# Altium project GSM Security Alert.PrjPcb
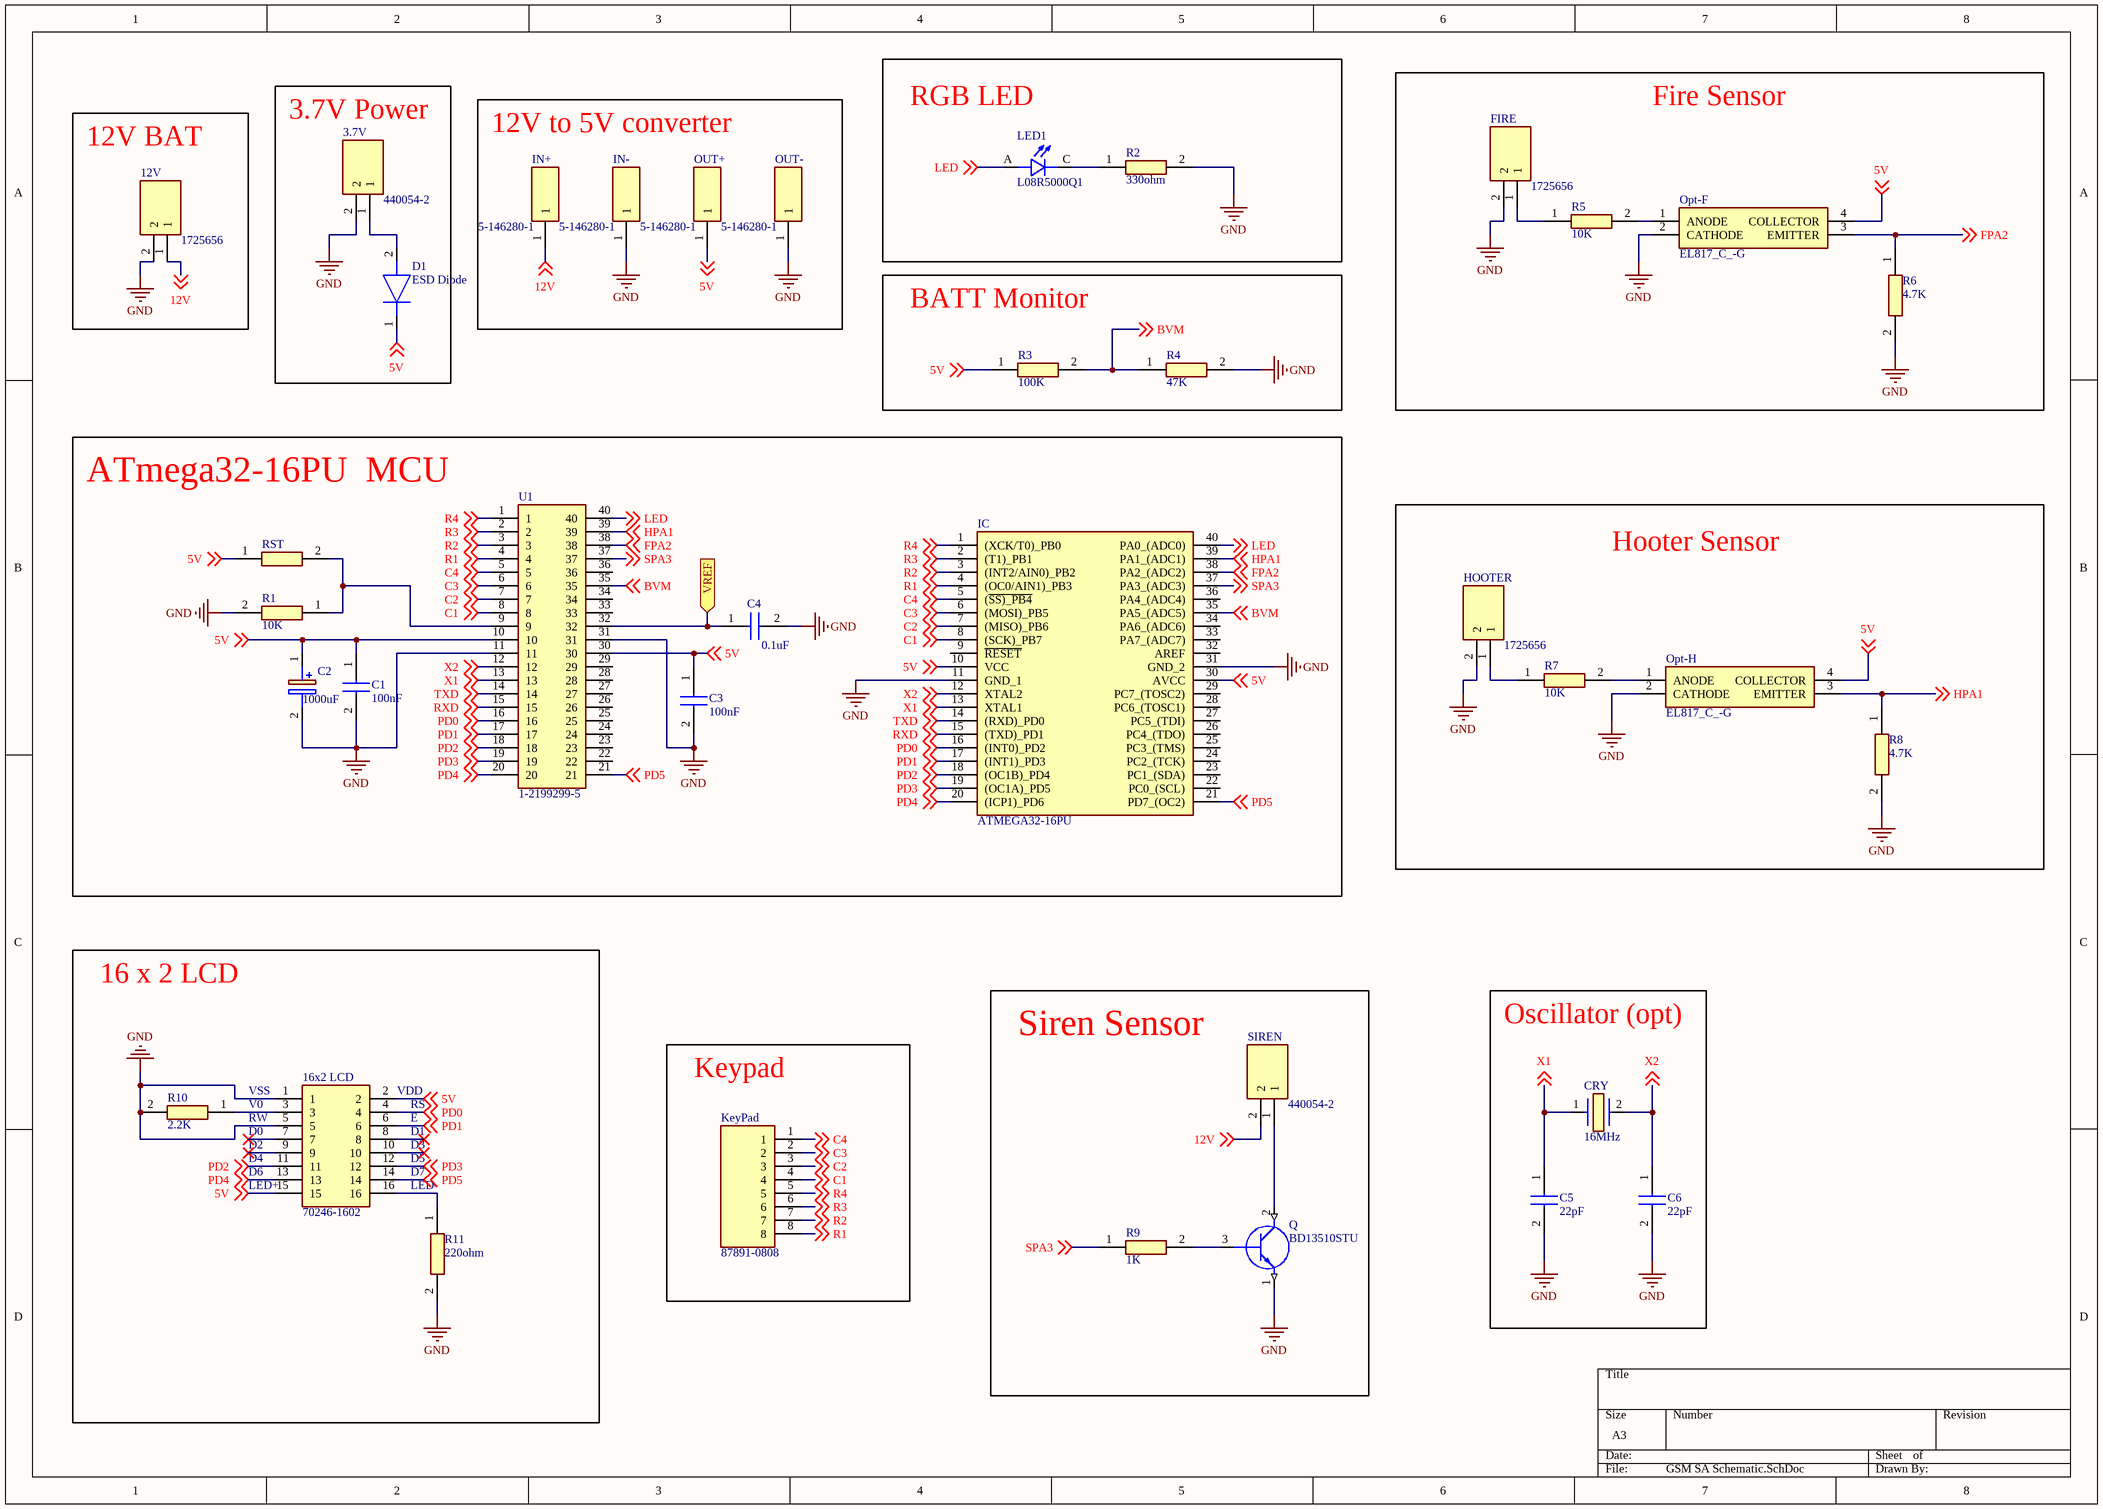
[diagram p0: GSM SA Schematic.SchDoc]
2 sheets, 69 parts. Net scope: flat (ports and power ports of the same name join across sheets).
Board file: GSM.PcbDoc
Sheets:
  GSM SA Schematic.SchDoc
  SIM800C SCH.SchDoc

## Sheet GSM SA Schematic.SchDoc
size A3; SheetNumber: 1; SheetTotal: 2

### Parts
3.7V  440054-2  [SHDR2W70P0X200_1X2_600X470X635P]
12V  1725656  [1725656]
16x2_LCD  70246-1602  [SHDR16W99P254_2X8_2794X889X927P]
C1  100nF  [C1206]
C2  1000uF  [CAPPRD500W65D1000H1750]
C3  100nF  [C1206]
C4  0.1uF  [C1206]
C5  22pF  [C1206]
C6  22pF  [C1206]
CRY  16MHz  [ECS160185PXGMTR]
D1  ESD Diode  [DIOM5336X262N]
FIRE  1725656  [1725656]
HOOTER  1725656  [1725656]
IC  ATMEGA32-16PU  [DIP1556W56P254L5232H483Q40N]
IN+  5-146280-1  [HDRV1W67P0X254_1X1_213X234X821P]
IN-  5-146280-1  [HDRV1W67P0X254_1X1_213X234X821P]
KeyPad  87891-0808  [HDRV8W69P0X254_1X8_2032X251X1641P]
LED1  L08R5000Q1  [LEDRD254W57D500H1070]
Opt-F  EL817_C_-G  [DIP762W60P254L458H480Q4N]
Opt-H  EL817_C_-G  [DIP762W60P254L458H480Q4N]
OUT+  5-146280-1  [HDRV1W67P0X254_1X1_213X234X821P]
OUT-  5-146280-1  [HDRV1W67P0X254_1X1_213X234X821P]
Q  BD13510STU  [TO229P345X800X1460-3P]
R1  10K  [RESC3216X65N]
R2  330ohm  [RESC3216X65N]
R3  100K  [RESC3216X65N]
R4  47K  [RESC3216X65N]
R5  10K  [RESC3216X65N]
R6  4.7K  [RESC3216X65N]
R7  10K  [RESC3216X65N]
R8  4.7K  [RESC3216X65N]
R9  1K  [RESC3116X65N]
R10  2.2K  [RESC3216X65N]
R11  220ohm  [RESC3216X65N]
RST  NP  [RESC3216X65N]  (value not drawn)
SIREN  440054-2  [SHDR2W70P0X200_1X2_600X470X635P]
U1  1-2199299-5  [DIPS1544W70P254L5080H530Q40N]

### Blocks framed on the sheet
RGB LED: LED1 R2
12V BAT: 12V
3.7V Power: 3.7V D1
12V to 5V converter: IN+ IN- OUT+ OUT-
Fire Sensor: FIRE Opt-F R5 R6
BATT Monitor: R3 R4
ATmega32-16PU  MCU: C1-C4 IC R1 RST U1
Hooter Sensor: HOOTER Opt-H R7 R8
16 x 2 LCD: 16x2_LCD R10 R11
Siren Sensor: Q R9 SIREN
Oscillator (opt): C5 C6 CRY
Keypad: KeyPad

### Ports
VREF (in)

### Nets
GND: 3.7V.2 12V.2 16x2_LCD.1 16x2_LCD.5 C1.2 C2.2(-) C3.2 C4.2 C5.2 C6.2 FIRE.2 HOOTER.2 IC.11(GND_1) IC.31(GND_2) IN-.1 Opt-F.2(CATHODE) Opt-H.2(CATHODE) OUT-.1 Q.1(E) R1.2 R2.2 R4.2 R6.2 R8.2 R10.2 R11.2 U1.11 U1.31
5V: 16x2_LCD.2 16x2_LCD.15 C1.1 C2.1(+) C3.1 D1.1(K) IC.10(VCC) IC.30(AVCC) Opt-F.4(COLLECTOR) Opt-H.4(COLLECTOR) OUT+.1 R3.1 RST.1 U1.10 U1.30 ; off-sheet 5V
12V: 12V.1 IN+.1 SIREN.2 ; off-sheet 12V
BVM: IC.35(PA5_(ADC5)) R3.2 R4.1 U1.35 ; off-sheet BVM
C1: IC.8((SCK)_PB7) KeyPad.4 U1.8 ; off-sheet C1
C2: IC.7((MISO)_PB6) KeyPad.3 U1.7 ; off-sheet C2
C3: IC.6((MOSI)_PB5) KeyPad.2 U1.6 ; off-sheet C3
C4: IC.5((~{SS)_PB4}) KeyPad.1 U1.5 ; off-sheet C4
FPA2: IC.38(PA2_(ADC2)) Opt-F.3(EMITTER) R6.1 U1.38 ; off-sheet FPA2
HPA1: IC.39(PA1_(ADC1)) Opt-H.3(EMITTER) R8.1 U1.39 ; off-sheet HPA1
LED: IC.40(PA0_(ADC0)) LED1.A U1.40 ; off-sheet LED
PD0: 16x2_LCD.4 IC.16((INT0)_PD2) U1.16 ; off-sheet PD0
PD1: 16x2_LCD.6 IC.17((INT1)_PD3) U1.17 ; off-sheet PD1
PD2: 16x2_LCD.11 IC.18((OC1B)_PD4) U1.18 ; off-sheet PD2
PD3: 16x2_LCD.12 IC.19((OC1A)_PD5) U1.19 ; off-sheet PD3
PD4: 16x2_LCD.13 IC.20((ICP1)_PD6) U1.20 ; off-sheet PD4
PD5: 16x2_LCD.14 IC.21(PD7_(OC2)) U1.21 ; off-sheet PD5
R1: IC.4((OC0/AIN1)_PB3) KeyPad.8 U1.4 ; off-sheet R1
R2: IC.3((INT2/AIN0)_PB2) KeyPad.7 U1.3 ; off-sheet R2
R3: IC.2((T1)_PB1) KeyPad.6 U1.2 ; off-sheet R3
R4: IC.1((XCK/T0)_PB0) KeyPad.5 U1.1 ; off-sheet R4
RXD: IC.15((TXD)_PD1) U1.15 ; off-sheet RXD
SPA3: IC.37(PA3_(ADC3)) R9.1 U1.37 ; off-sheet SPA3
TXD: IC.14((RXD)_PD0) U1.14 ; off-sheet TXD
X1: C5.1 CRY.1 IC.13(XTAL1) U1.13 ; off-sheet X1
X2: C6.1 CRY.2 IC.12(XTAL2) U1.12 ; off-sheet X2
Net3.7V_1: 3.7V.1 D1.2(A)
Net16x2_LCD_3: 16x2_LCD.3 R10.1
Net16x2_LCD_16: 16x2_LCD.16 R11.1
NetC4_1: C4.1 U1.32 ; port VREF
NetFIRE_1: FIRE.1 R5.1
NetHOOTER_1: HOOTER.1 R7.1
NetLED1_C: LED1.C R2.1
NetOpt-F_1: Opt-F.1(ANODE) R5.2
NetOpt-H_1: Opt-H.1(ANODE) R7.2
NetQ_2: Q.2(C) SIREN.1
NetQ_3: Q.3(B) R9.2
NetR1_1: R1.1 RST.2 U1.9

Not connected (* = marked no-connect by the designer): 16x2_LCD 7* 8* 9* 10*; IC 9(~{RESET}) 22(PC0_(SCL)) 23(PC1_(SDA)) 24(PC2_(TCK)) 25(PC3_(TMS)) 26(PC4_(TDO)) 27(PC5_(TDI)) 28(PC6_(TOSC1)) 29(PC7_(TOSC2)) 32(AREF) 33(PA7_(ADC7)) 34(PA6_(ADC6)) 36(PA4_(ADC4)); U1 22 23 24 25 26 27 28 29 33 34 36

### Notes on the sheet
- VSS
- V0
- RW
- (near 16x2_LCD) VDD
- (near 16x2_LCD) RS
- (near 16x2_LCD) E
- D0
- D2
- D4
- (near 16x2_LCD) D6
- (near 16x2_LCD) LED+
- (near 16x2_LCD) D1
- (near 16x2_LCD) D3
- (near 16x2_LCD) D5
- D7
- LED-

### Library data of the parts
3.7V SIREN = 440054-2: Connector; Manufacturer_Name: TE Connectivity; Datasheet Link: https://www.te.com/commerce/DocumentDelivery/DDEController?Action=showdoc&DocId=Customer+Drawing%7F440054%7FF8%7Fpdf%7FEnglish%7FENG_CD_440054_F8.pdf%7F1-440054-2; Height: 6.35mm; Manufacturer_Part_Number: 440054-2; Mouser Part Number: 571-440054-2; Mouser Price/Stock: https://www.mouser.co.uk/ProductDetail/TE-Connectivity/440054-2?qs=JFPmFzpscO4RQaczYEA68w%3D%3D; Arrow Part Number: 440054-2; Arrow Price/Stock: https://www.arrow.com/en/products/440054-2/te-connectivity?region=europe
12V FIRE HOOTER = 1725656: Connector; Manufacturer_Name: Phoenix Contact; Datasheet Link: https://www.phoenixcontact.com/online/portal/us/?uri=pxc-oc-itemdetail:pid=1725656&library=usen&pcck=P-11-01-05&tab=1&selectedCategory=ALL; Height: 8.65mm; Manufacturer_Part_Number: 1725656; Mouser Part Number: 651-1725656; Mouser Price/Stock: https://www.mouser.co.uk/ProductDetail/Phoenix-Contact/1725656?qs=Ul7CXFMnlWWQeccayYbRmw%3D%3D; Arrow Part Number: 1725656; Arrow Price/Stock: https://www.arrow.com/en/products/1725656/phoenix-contact?region=nac
16x2_LCD = 70246-1602: Headers & Wire Housings 2.54mm CGrid Hdr Shr d /Slt .76AuLF 16Ckt; Manufacturer_Name: Molex; Geometry.Height: 9.27mm; Mouser Part Number: 538-70246-1602; Mouser Price/Stock: https://www.mouser.co.uk/ProductDetail/Molex/70246-1602?qs=Y%2FrI5Y8Al89vLxTpaytoaQ%3D%3D; Manufacturer_Part_Number: 70246-1602; Datasheet Link: https://www.molex.com/pdm_docs/sd/702461602_sd.pdf
C1 C3 = C1206C150F5GACTU: 100nF 5% tolerance 50VDC Capacitor; Manufacturer_Name: KEMET; Datasheet Link: https://content.kemet.com/datasheets/KEM_C1003_C0G_SMD.pdf; Manufacturer_Part_Number: C1206C150F5GACTU; Mouser Part Number: 80-C1206C150F5GACTU; Mouser Price/Stock: https://www.mouser.co.uk/ProductDetail/KEMET/C1206C150F5GACTU?qs=ds50AKTGxA8Yi2FrC9bQqw%3D%3D
C2 = EEU-HD1E102B: 1000uF 25VDC Capacitor Polarised; Manufacturer_Name: Panasonic; Datasheet Link: http://industrial.panasonic.com/cdbs/www-data/pdf/RDF0000/ABA0000C1035.pdf; Height: 17.5mm; Manufacturer_Part_Number: EEU-HD1E102B; Mouser Part Number: 667-EEU-HD1E102B; Mouser Price/Stock: https://www.mouser.com/Search/Refine.aspx?Keyword=667-EEU-HD1E102B; Arrow Part Number: EEU-HD1E102B; Arrow Price/Stock: https://www.arrow.com/en/products/eeu-hd1e102b/panasonic
C4 = C1206C150F5GACTU: 0.1uF 5% tolerance 50VDC Capacitor; Manufacturer_Name: KEMET; Datasheet Link: https://content.kemet.com/datasheets/KEM_C1003_C0G_SMD.pdf; Manufacturer_Part_Number: C1206C150F5GACTU; Mouser Part Number: 80-C1206C150F5GACTU; Mouser Price/Stock: https://www.mouser.co.uk/ProductDetail/KEMET/C1206C150F5GACTU?qs=ds50AKTGxA8Yi2FrC9bQqw%3D%3D
C5 C6 = C1206C150F5GACTU: 22pF 10% tolerance 50VDC tolerance Capacitor; Manufacturer_Name: KEMET; Datasheet Link: https://content.kemet.com/datasheets/KEM_C1003_C0G_SMD.pdf; Manufacturer_Part_Number: C1206C150F5GACTU; Mouser Part Number: 80-C1206C150F5GACTU; Mouser Price/Stock: https://www.mouser.co.uk/ProductDetail/KEMET/C1206C150F5GACTU?qs=ds50AKTGxA8Yi2FrC9bQqw%3D%3D
CRY = ECS-160-18-5PX-GM-TR: Crystal or Oscillator; Manufacturer_Name: ECS; Datasheet Link: https://www.mouser.com/datasheet/2/122/csm_7x-1841291.pdf; Height: 4.3mm; Manufacturer_Part_Number: ECS-160-18-5PX-GM-TR; Mouser Part Number: 520-160-18-5PX-GM-TR; Mouser Price/Stock: https://www.mouser.co.uk/ProductDetail/ECS/ECS-160-18-5PX-GM-TR?qs=amGC7iS6iy9jy4CztfLIlw%3D%3D
D1 = SMBJ5.0CA-13-F: ESD Suppressors / TVS Diodes 600W 5.0V; Manufacturer_Name: Diodes Incorporated; Datasheet Link: http://uk.rs-online.com/web/p/products/1222405; Height: 2.62mm; Manufacturer_Part_Number: SMBJ5.0CA-13-F; Mouser Part Number: 621-SMBJ5.0CA-13-F; Mouser Price/Stock: https://www.mouser.co.uk/ProductDetail/Diodes-Incorporated/SMBJ5.0CA-13-F?qs=gaDBXWSqsDAkxXz1%252BnNiVg%3D%3D; Arrow Part Number: SMBJ5.0CA-13-F; Arrow Price/Stock: https://www.arrow.com/en/products/smbj5.0ca-13-f/diodes-incorporated?region=nac
IC = ATMEGA32-16PU: Integrated Circuit; Manufacturer_Name: Microchip; Datasheet Link: https://datasheet.datasheetarchive.com/originals/distributors/Datasheets_SAMA/d5bf27914111a61a5f5ef80f30f6d660.pdf; Height: 4.826mm; Manufacturer_Part_Number: ATMEGA32-16PU; Mouser Part Number: 556-ATMEGA32-16PU; Mouser Price/Stock: https://www.mouser.co.uk/ProductDetail/Microchip-Technology/ATMEGA32-16PU?qs=aqrrBurbvGdpkmgj7RWmsQ%3D%3D; Arrow Part Number: ATMEGA32-16PU; Arrow Price/Stock: https://www.arrow.com/en/products/atmega32-16pu/microchip-technology?region=nac
IN+ IN- OUT+ OUT- = 5-146280-1: AMP - TE CONNECTIVITY - 5-146280-1 - 01 MODII HDR SRST B/A LF; Geometry.Height: 8.21mm; Mouser Part Number: 571-51462801; Mouser Price/Stock: https://www.mouser.co.uk/ProductDetail/TE-Connectivity/5-146280-1?qs=bwpFY26eRVcArW7BMMLddw%3D%3D; Manufacturer_Name: TE Connectivity; Manufacturer_Part_Number: 5-146280-1; Datasheet Link: https://www.te.com/commerce/DocumentDelivery/DDEController?Action=showdoc&DocId=Customer+Drawing%7F146280%7FH2%7Fpdf%7FEnglish%7FENG_CD_146280_H2.pdf%7F5-146280-1
KeyPad = 87891-0808: Connector; Manufacturer_Name: Molex; Datasheet Link: https://www.molex.com/pdm_docs/sd/878910808_sd.pdf; Height: 16.41mm; Manufacturer_Part_Number: 87891-0808; Mouser Part Number: 538-87891-0808; Mouser Price/Stock: https://www.mouser.co.uk/ProductDetail/Molex/87891-0808?qs=iLbezkQI%252Bsh%252BavKMBAJgwA%3D%3D
LED1 = L08R5000Q1: LED, 5MM, ORANGE; LED / Lamp Size: 5mm / T-1 3/4; LED Colour: Orange; Typ Luminous Intensity: 4.3mcd; Viewing Angle: ...; MF: LED Technology; Value: *; SnapEDA_Link: https://www.snapeda.com/parts/L08R5000Q1/LED+Technology/view-part/?ref=snap; MP: L08R5000Q1; Check_prices: https://www.snapeda.com/parts/L08R5000Q1/LED+Technology/view-part/?ref=eda; Availability: In Stock; Price: None; Package: None
Opt-F Opt-H = EL817_C_-G: Integrated Circuit; Manufacturer_Name: Everlight; Manufacturer_Part_Number: EL817(C)-G; Datasheet Link: https://componentsearchengine.com/Datasheets/1/EL817(C)-G.pdf; Height: 4.8mm; Mouser Part Number: 638-EL817C-G; Mouser Price/Stock: https://www.mouser.co.uk/ProductDetail/Everlight/EL817C-G?qs=8PzhAHr7IdMbkL15850MTg%3D%3D; Arrow Part Number: EL817(C)-G; Arrow Price/Stock: https://www.arrow.com/en/products/el817-c-g/everlight-electronics?region=nac
Q = BD13510STU: Transistor BJT NPN; Manufacturer_Name: onsemi; Datasheet Link: https://datasheet.datasheetarchive.com/originals/distributors/Datasheets_SAMA/6000e099be6481169b0ff4f49553d5da.pdf; Height: 3.45mm; Manufacturer_Part_Number: BD13510STU; Mouser Part Number: 512-BD13510STU; Mouser Price/Stock: https://www.mouser.co.uk/ProductDetail/onsemi-Fairchild/BD13510STU?qs=XVly9zr84oIAutVRL%2FrhQQ%3D%3D; Arrow Part Number: BD13510STU; Arrow Price/Stock: https://www.arrow.com/en/products/bd13510stu/on-semiconductor?region=nac
R1 R5 R7 = TNPW12065K00BEEN: 10K 1% tolerance Resistor; Manufacturer_Name: Vishay; Datasheet Link: https://www.mouser.co.uk/ProductDetail/Vishay-Dale/TNPW12065K00BEEN/?qs=jYh4YNbhoK0CHBzi35%2Fb3A%3D%3D; Height: 0.65mm; Manufacturer_Part_Number: TNPW12065K00BEEN; Mouser Part Number: 71-TNPW12065K00BEEN; Mouser Price/Stock: https://www.mouser.co.uk/ProductDetail/Vishay-Dale/TNPW12065K00BEEN/?qs=jYh4YNbhoK0CHBzi35%2Fb3A%3D%3D
R2 = TNPW12065K00BEEN: 330ohm 1% Tolerance Resistor; Manufacturer_Name: Vishay; Datasheet Link: https://www.mouser.co.uk/ProductDetail/Vishay-Dale/TNPW12065K00BEEN/?qs=jYh4YNbhoK0CHBzi35%2Fb3A%3D%3D; Height: 0.65mm; Manufacturer_Part_Number: TNPW12065K00BEEN; Mouser Part Number: 71-TNPW12065K00BEEN; Mouser Price/Stock: https://www.mouser.co.uk/ProductDetail/Vishay-Dale/TNPW12065K00BEEN/?qs=jYh4YNbhoK0CHBzi35%2Fb3A%3D%3D
R3 = TNPW12065K00BEEN: 100K 1% tolerance Resistor; Manufacturer_Name: Vishay; Datasheet Link: https://www.mouser.co.uk/ProductDetail/Vishay-Dale/TNPW12065K00BEEN/?qs=jYh4YNbhoK0CHBzi35%2Fb3A%3D%3D; Height: 0.65mm; Manufacturer_Part_Number: TNPW12065K00BEEN; Mouser Part Number: 71-TNPW12065K00BEEN; Mouser Price/Stock: https://www.mouser.co.uk/ProductDetail/Vishay-Dale/TNPW12065K00BEEN/?qs=jYh4YNbhoK0CHBzi35%2Fb3A%3D%3D
R4 = TNPW12065K00BEEN: 47K 1% tolerance Resistor; Manufacturer_Name: Vishay; Datasheet Link: https://www.mouser.co.uk/ProductDetail/Vishay-Dale/TNPW12065K00BEEN/?qs=jYh4YNbhoK0CHBzi35%2Fb3A%3D%3D; Height: 0.65mm; Manufacturer_Part_Number: TNPW12065K00BEEN; Mouser Part Number: 71-TNPW12065K00BEEN; Mouser Price/Stock: https://www.mouser.co.uk/ProductDetail/Vishay-Dale/TNPW12065K00BEEN/?qs=jYh4YNbhoK0CHBzi35%2Fb3A%3D%3D
R6 = TNPW12065K00BEEN: 4.7K 1% tolerance  Resistor; Manufacturer_Name: Vishay; Datasheet Link: https://www.mouser.co.uk/ProductDetail/Vishay-Dale/TNPW12065K00BEEN/?qs=jYh4YNbhoK0CHBzi35%2Fb3A%3D%3D; Height: 0.65mm; Manufacturer_Part_Number: TNPW12065K00BEEN; Mouser Part Number: 71-TNPW12065K00BEEN; Mouser Price/Stock: https://www.mouser.co.uk/ProductDetail/Vishay-Dale/TNPW12065K00BEEN/?qs=jYh4YNbhoK0CHBzi35%2Fb3A%3D%3D
R8 = TNPW12065K00BEEN: 4.7K 1% tolerance Resistor; Manufacturer_Name: Vishay; Datasheet Link: https://www.mouser.co.uk/ProductDetail/Vishay-Dale/TNPW12065K00BEEN/?qs=jYh4YNbhoK0CHBzi35%2Fb3A%3D%3D; Height: 0.65mm; Manufacturer_Part_Number: TNPW12065K00BEEN; Mouser Part Number: 71-TNPW12065K00BEEN; Mouser Price/Stock: https://www.mouser.co.uk/ProductDetail/Vishay-Dale/TNPW12065K00BEEN/?qs=jYh4YNbhoK0CHBzi35%2Fb3A%3D%3D
R9 = CMP1206-FX-1001ELF: 1k 1% tolerance Resistor; Manufacturer_Name: Bourns; Datasheet Link: https://pt.mouser.com/datasheet/2/54/Bourns_CMP_Datasheet_05.28.20-1854233.pdf; Height: 0.65mm; Manufacturer_Part_Number: CMP1206-FX-1001ELF; Mouser Part Number: 652-CMP1206-FX-1001L; Mouser Price/Stock: https://www.mouser.co.uk/ProductDetail/Bourns/CMP1206-FX-1001ELF?qs=TiOZkKH1s2QqK9iocF6aGg%3D%3D
R10 = TNPW12065K00BEEN: 2.2K 1% tolerance Resistor; Manufacturer_Name: Vishay; Datasheet Link: https://www.mouser.co.uk/ProductDetail/Vishay-Dale/TNPW12065K00BEEN/?qs=jYh4YNbhoK0CHBzi35%2Fb3A%3D%3D; Height: 0.65mm; Manufacturer_Part_Number: TNPW12065K00BEEN; Mouser Part Number: 71-TNPW12065K00BEEN; Mouser Price/Stock: https://www.mouser.co.uk/ProductDetail/Vishay-Dale/TNPW12065K00BEEN/?qs=jYh4YNbhoK0CHBzi35%2Fb3A%3D%3D
R11 = TNPW12065K00BEEN: 220ohm 1% tolerance Resistor; Manufacturer_Name: Vishay; Datasheet Link: https://www.mouser.co.uk/ProductDetail/Vishay-Dale/TNPW12065K00BEEN/?qs=jYh4YNbhoK0CHBzi35%2Fb3A%3D%3D; Height: 0.65mm; Manufacturer_Part_Number: TNPW12065K00BEEN; Mouser Part Number: 71-TNPW12065K00BEEN; Mouser Price/Stock: https://www.mouser.co.uk/ProductDetail/Vishay-Dale/TNPW12065K00BEEN/?qs=jYh4YNbhoK0CHBzi35%2Fb3A%3D%3D
RST = TNPW12065K00BEEN: 2 pin Switch; Manufacturer_Name: Vishay; Datasheet Link: https://www.mouser.co.uk/ProductDetail/Vishay-Dale/TNPW12065K00BEEN/?qs=jYh4YNbhoK0CHBzi35%2Fb3A%3D%3D; Height: 0.65mm; Manufacturer_Part_Number: TNPW12065K00BEEN; Mouser Part Number: 71-TNPW12065K00BEEN; Mouser Price/Stock: https://www.mouser.co.uk/ProductDetail/Vishay-Dale/TNPW12065K00BEEN/?qs=jYh4YNbhoK0CHBzi35%2Fb3A%3D%3D
U1 = 1-2199299-5: Connector; Manufacturer_Name: TE Connectivity; Datasheet Link: https://www.te.com/commerce/DocumentDelivery/DDEController?Action=showdoc&DocId=Customer+Drawing%7F2199299%7FA%7Fpdf%7FEnglish%7FENG_CD_2199299_A_baseFilename.pdf%7F1-2199299-5; Height: 5.3mm; Manufacturer_Part_Number: 1-2199299-5; Mouser Part Number: 571-1-2199299-5; Mouser Price/Stock: https://www.mouser.co.uk/ProductDetail/TE-Connectivity/1-2199299-5?qs=fK8dlpkaUMthXjoyadQV1Q%3D%3D; Arrow Part Number: 1-2199299-5; Arrow Price/Stock: https://www.arrow.com/en/products/1-2199299-5/te-connectivity?region=europe

## Sheet SIM800C SCH.SchDoc
size A3; SheetNumber: 2; SheetTotal: 2
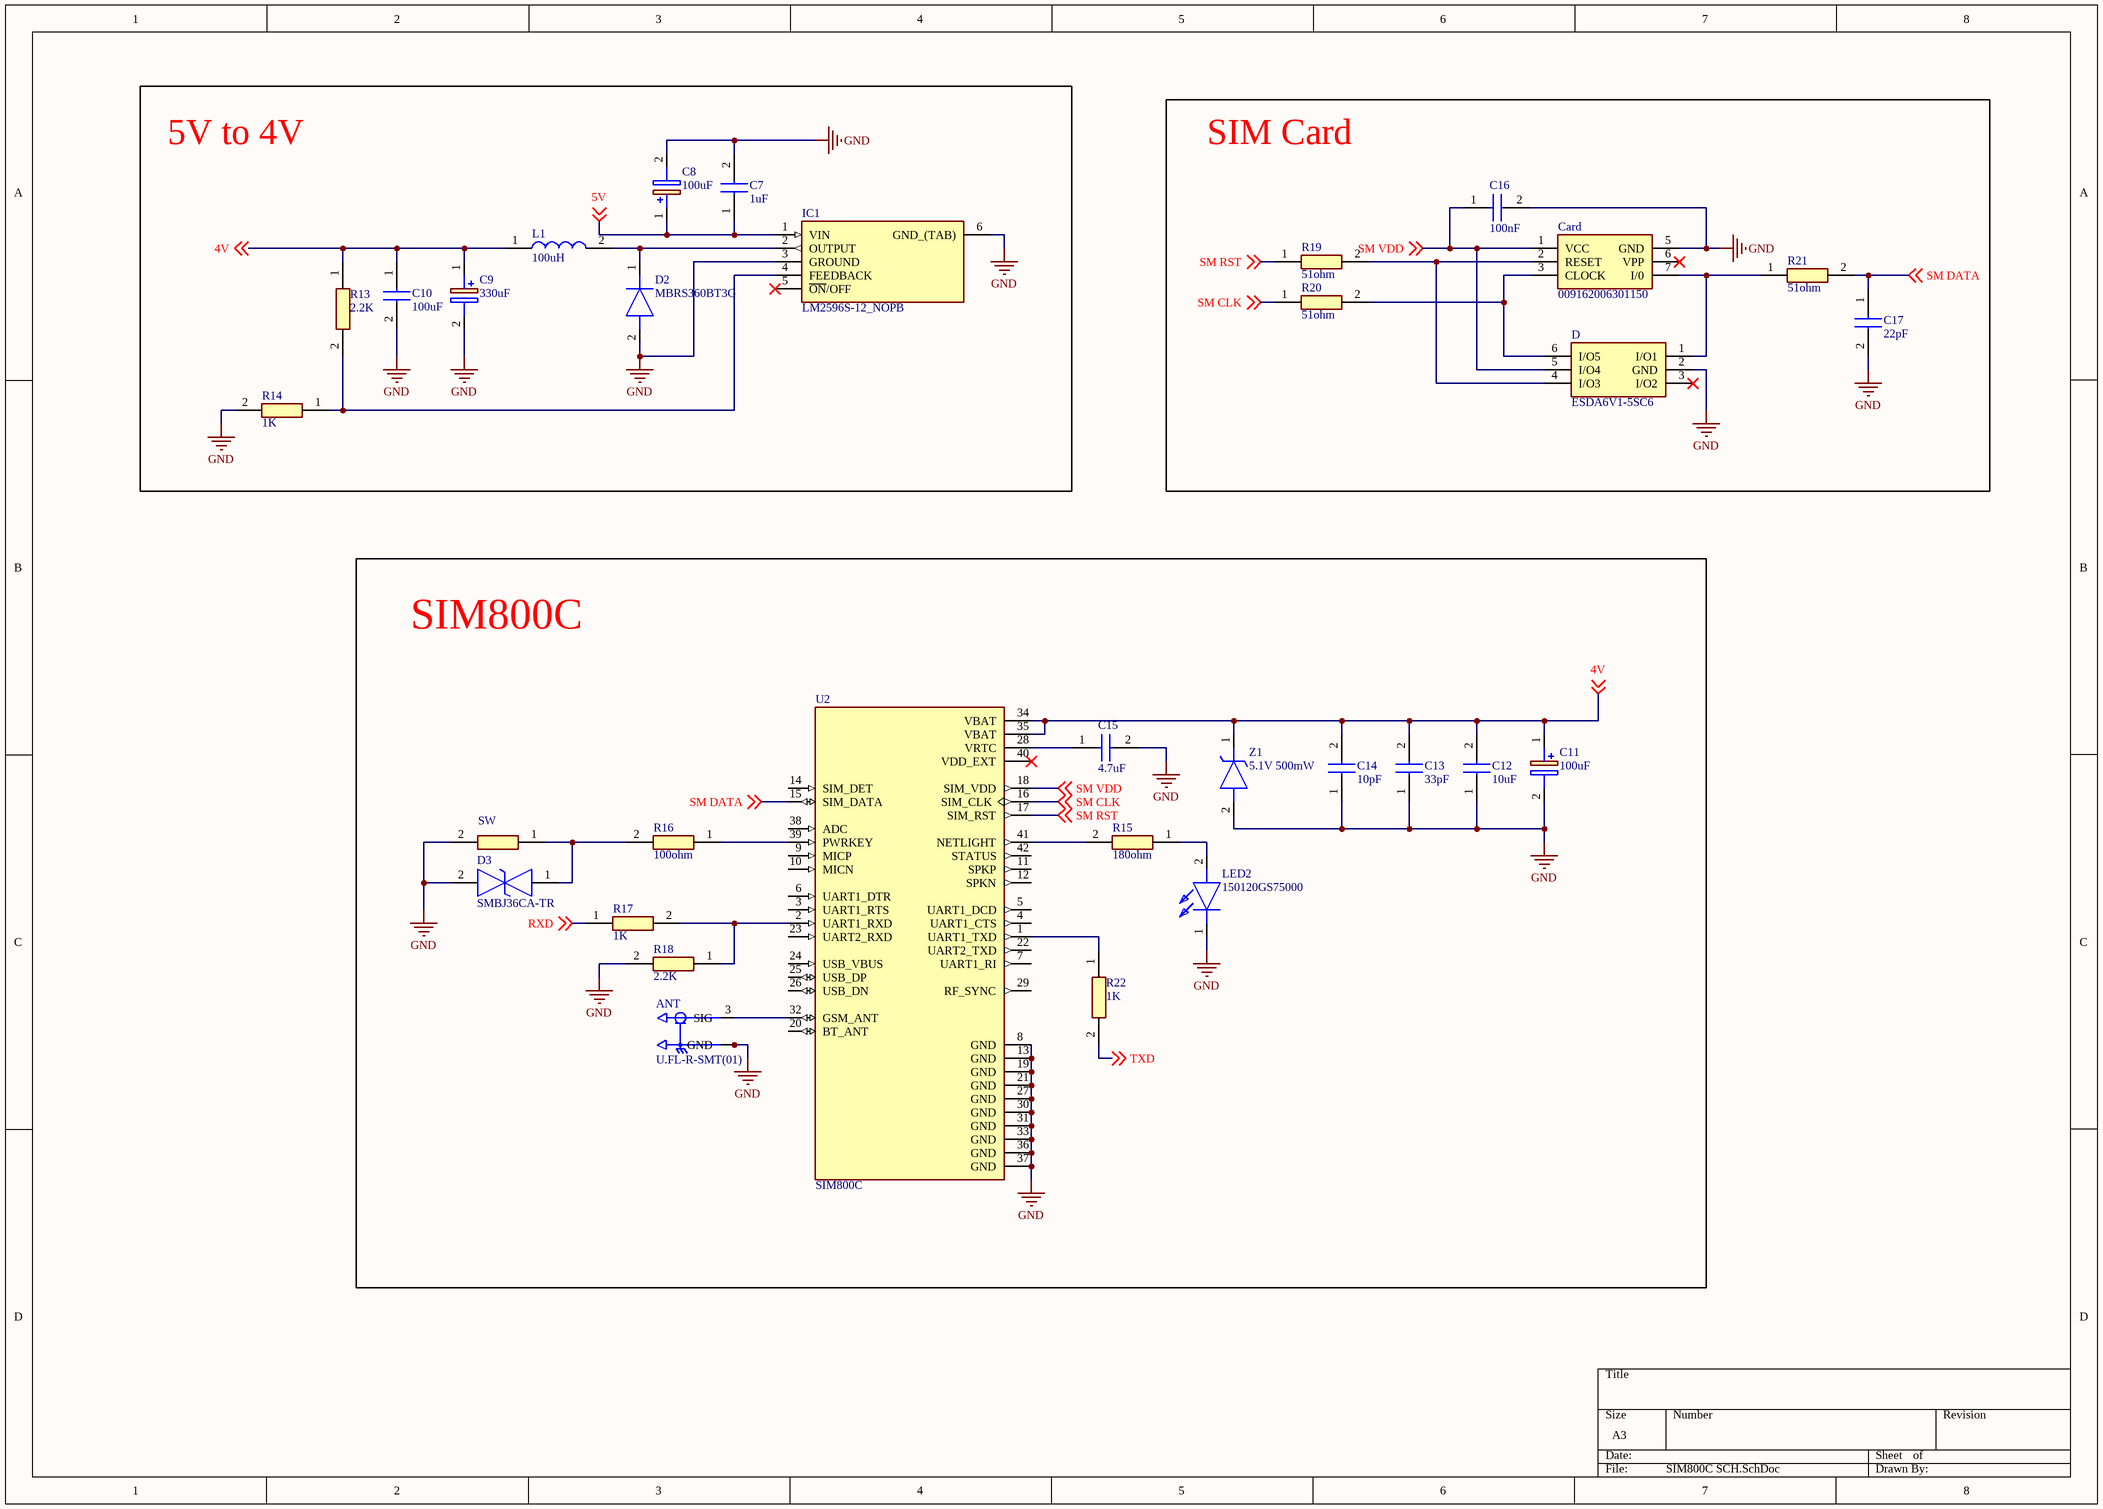
[diagram p1: SIM800C SCH.SchDoc]

### Parts
ANT  U.FL-R-SMT(01)  [HRS_U.FL-R-SMT(01)]
C7  1uF  [CAPC3216X127N]
C8  100uF  [CAPAE660X800N]
C9  330uF  [EEETC1V470P]
C10  100uF  [CAPC3216X127N]
C11  100uF  [T510E]
C12  10uF  [CAPC3216X127N]
C13  33pF  [CAPC3216X127N]
C14  10pF  [CAPC3216X127N]
C15  4.7uF  [CAPC3216X127N]
C16  100nF  [CAPC3216X127N]
C17  22pF  [CAPC3216X170N]
Card  009162006301150  [009162006301150]
D  ESDA6V1-5SC6  [SOT95P280X145-6N]
D2  MBRS360BT3G  [DIOM5436X247N]
D3  SMBJ36CA-TR  [SMBJ50CA]
IC1  LM2596S-12_NOPB  [TO170P1435X465-6N]
L1  100uH  [RLH0912101KL]
LED2  150120GS75000  [LEDC3214X78N]
R13  2.2K  [RESC3216X51N]
R14  1K  [RESC3216X51N]
R15  180ohm  [RESC3216X51N]
R16  100ohm  [RESC3216X51N]
R17  1K  [RESC3216X51N]
R18  2.2K  [RESC3216X51N]
R19  51ohm  [RESC3216X60N]
R20  51ohm  [RESC3216X60N]
R21  51ohm  [RESC3216X60N]
R22  1K  [RESC3216X51N]
SW  PHPA1206E1001BST1  [RESC3216X51N]  (value not drawn)
U2  SIM800C  [LCC110P1570X1760X250-42N]
Z1  5.1V 500mW  [SOD3716X135N]

### Blocks framed on the sheet
5V to 4V: C7-C10 D2 IC1 L1 R13 R14
SIM Card: C16 C17 Card D R19-R21
SIM800C: ANT C11-C15 D3 LED2 R15-R18 R22 SW U2 Z1

### Nets
GND: ANT.1(GND) ANT.2(GND) C7.2 C8.2(-) C9.2(-) C10.2 C11.2(-) C12.1 C13.1 C14.1 C15.2 C16.2 C17.2 Card.5(GND) D.2(GND) D2.2(A) D3.2 IC1.3(GROUND) IC1.6(GND_(TAB)) LED2.1(K) R14.2 R18.2 SW.2 U2.8(GND) U2.13(GND) U2.19(GND) U2.21(GND) U2.27(GND) U2.30(GND) U2.31(GND) U2.33(GND) U2.36(GND) U2.37(GND) Z1.2(A)
4V: C9.1(+) C10.1 C11.1(+) C12.2 C13.2 C14.2 L1.1 R13.1 U2.34(VBAT) U2.35(VBAT) Z1.1(K) ; off-sheet 4V
5V: C7.1 C8.1(+) IC1.1(VIN) ; off-sheet 5V
RXD: R17.1 ; off-sheet RXD
SM CLK: R20.1 U2.16(SIM_CLK) ; off-sheet SM CLK
SM DATA: C17.1 R21.2 U2.15(SIM_DATA) ; off-sheet SM DATA
SM RST: R19.1 U2.17(SIM_RST) ; off-sheet SM RST
SM VDD: C16.1 Card.1(VCC) D.5(I/O4) U2.18(SIM_VDD) ; off-sheet SM VDD
TXD: R22.2 ; off-sheet TXD
NetANT_3: ANT.3(SIG) U2.32(GSM_ANT)
NetC15_1: C15.1 U2.28(VRTC)
NetCard_2: Card.2(RESET) D.4(I/O3) R19.2
NetCard_3: Card.3(CLOCK) D.6(I/O5) R20.2
NetCard_7: Card.7(I/0) D.1(I/O1) R21.1
NetD2_1: D2.1(K) IC1.2(OUTPUT) L1.2
NetD3_1: D3.1 R16.2 SW.1
NetIC1_4: IC1.4(FEEDBACK) R13.2 R14.1
NetLED2_2: LED2.2(A) R15.1
NetR15_2: R15.2 U2.41(NETLIGHT)
NetR16_1: R16.1 U2.39(PWRKEY)
NetR17_2: R17.2 R18.1 U2.2(UART1_RXD)
NetR22_1: R22.1 U2.1(UART1_TXD)

Not connected (* = marked no-connect by the designer): Card 6(VPP)*; D 3(I/O2)*; IC1 5(~{ON}/OFF)*; U2 3(UART1_RTS) 4(UART1_CTS) 5(UART1_DCD) 6(UART1_DTR) 7(UART1_RI) 9(MICP) 10(MICN) 11(SPKP) 12(SPKN) 14(SIM_DET) 20(BT_ANT) 22(UART2_TXD) 23(UART2_RXD) 24(USB_VBUS) 25(USB_DP) 26(USB_DN) 29(RF_SYNC) 38(ADC) 40(VDD_EXT)* 42(STATUS)

### Library data of the parts
ANT = U.FL-R-SMT(01): U.FL (UMCC) Connector Receptacle, Male Pin 50Ohm Surface Mount Solder. RF Connectors / Coaxial Connectors; MF: Hirose; Check_prices: https://www.snapeda.com/parts/U.FL-R-SMT(01)/Hirose+Electric+Co+Ltd/view-part/?ref=eda; Value: *; Availability: In Stock; MP: U.FL-R-SMT(01); Price: None; Package: None; SnapEDA_Link: https://www.snapeda.com/parts/U.FL-R-SMT(01)/Hirose+Electric+Co+Ltd/view-part/?ref=snap; Purchase-URL: https://pricing.snapeda.com/search/part/U.FL-R-SMT(01)/?ref=eda
C7 C15 = 1206YC105JAT2A: Capacitor; Manufacturer_Name: AVX; Datasheet Link: https://spicat.kyocera-avx.com/product/mlcc/chartview/1206YC105JAT2A/DataSheet/X7R; Height: 1.27mm; Manufacturer_Part_Number: 1206YC105JAT2A; Mouser Part Number: 581-1206YC105J; Mouser Price/Stock: https://www.mouser.com/Search/Refine.aspx?Keyword=581-1206YC105J; Arrow Part Number: 1206YC105JAT2A; Arrow Price/Stock: https://www.arrow.com/en/products/1206yc105jat2a/avx
C8 = EEV107M025A9HAA: 100uF 25VDC 20% Capacitor Polarised; Manufacturer_Name: KEMET; Datasheet Link: https://content.kemet.com/datasheets/KEM_A4002_EEV.pdf; Height: 8mm; Manufacturer_Part_Number: EEV107M025A9HAA; Mouser Part Number: 80-EEV107M025A9HAA; Mouser Price/Stock: https://www.mouser.co.uk/ProductDetail/KEMET/EEV107M025A9HAA?qs=T9vdlufmP8y%2FxeVsq9Rq6w%3D%3D; Arrow Part Number: EEV107M025A9HAA; Arrow Price/Stock: https://www.arrow.com/en/products/eev107m025a9haa/kemet-corporation?region=nac
C9 = EEE-FH1E331UL: 330uF 20% tolerance 25VDC Capacitor Polarised; Manufacturer_Name: Panasonic; Datasheet Link: https://industrial.panasonic.com/cdbs/www-data/pdf/RDE0000/ast-ind-166561.pdf; Manufacturer_Part_Number: EEE-FH1E331UL
C10 = 1206YC105JAT2A: 100uF 10% tolerance 10VDC Capacitor; Manufacturer_Name: AVX; Datasheet Link: https://spicat.kyocera-avx.com/product/mlcc/chartview/1206YC105JAT2A/DataSheet/X7R; Height: 1.27mm; Manufacturer_Part_Number: 1206YC105JAT2A; Mouser Part Number: 581-1206YC105J; Mouser Price/Stock: https://www.mouser.com/Search/Refine.aspx?Keyword=581-1206YC105J; Arrow Part Number: 1206YC105JAT2A; Arrow Price/Stock: https://www.arrow.com/en/products/1206yc105jat2a/avx
C11 = T510E107M025ATE050: 100uF 25VDC Capacitor Polarised; Manufacturer_Name: KEMET; Datasheet Link: https://content.kemet.com/datasheets/KEM_T2014_T510.pdf; Height: 4.3mm; Manufacturer_Part_Number: T510E107M025ATE050; Mouser Part Number: 80-T510E107M025; Mouser Price/Stock: https://www.mouser.co.uk/ProductDetail/KEMET/T510E107M025ATE050?qs=WjQheL5Mt%2FDzPcz8%252Buuowg%3D%3D; Arrow Part Number: T510E107M025ATE050; Arrow Price/Stock: https://www.arrow.com/en/products/t510e107m025ate050/kemet-corporation?region=nac
C12 = 1206YC105JAT2A: 10uF 25VDC Capacitor; Manufacturer_Name: AVX; Datasheet Link: https://spicat.kyocera-avx.com/product/mlcc/chartview/1206YC105JAT2A/DataSheet/X7R; Height: 1.27mm; Manufacturer_Part_Number: 1206YC105JAT2A; Mouser Part Number: 581-1206YC105J; Mouser Price/Stock: https://www.mouser.com/Search/Refine.aspx?Keyword=581-1206YC105J; Arrow Part Number: 1206YC105JAT2A; Arrow Price/Stock: https://www.arrow.com/en/products/1206yc105jat2a/avx
C13 = 1206YC105JAT2A: 33pF 50VDC Capacitor; Manufacturer_Name: AVX; Datasheet Link: https://spicat.kyocera-avx.com/product/mlcc/chartview/1206YC105JAT2A/DataSheet/X7R; Height: 1.27mm; Manufacturer_Part_Number: 1206YC105JAT2A; Mouser Part Number: 581-1206YC105J; Mouser Price/Stock: https://www.mouser.com/Search/Refine.aspx?Keyword=581-1206YC105J; Arrow Part Number: 1206YC105JAT2A; Arrow Price/Stock: https://www.arrow.com/en/products/1206yc105jat2a/avx
C14 = 1206YC105JAT2A: 10pF 50VDC Capacitor; Manufacturer_Name: AVX; Datasheet Link: https://spicat.kyocera-avx.com/product/mlcc/chartview/1206YC105JAT2A/DataSheet/X7R; Height: 1.27mm; Manufacturer_Part_Number: 1206YC105JAT2A; Mouser Part Number: 581-1206YC105J; Mouser Price/Stock: https://www.mouser.com/Search/Refine.aspx?Keyword=581-1206YC105J; Arrow Part Number: 1206YC105JAT2A; Arrow Price/Stock: https://www.arrow.com/en/products/1206yc105jat2a/avx
C16 = 1206YC105JAT2A: 100nF 10% tolerance 50VDC Capacitor; Manufacturer_Name: AVX; Datasheet Link: https://spicat.kyocera-avx.com/product/mlcc/chartview/1206YC105JAT2A/DataSheet/X7R; Height: 1.27mm; Manufacturer_Part_Number: 1206YC105JAT2A; Mouser Part Number: 581-1206YC105J; Mouser Price/Stock: https://www.mouser.com/Search/Refine.aspx?Keyword=581-1206YC105J; Arrow Part Number: 1206YC105JAT2A; Arrow Price/Stock: https://www.arrow.com/en/products/1206yc105jat2a/avx
C17 = VJ1206A220JXGAT5Z: 22pF 10% tolerance 50VDC tolerance Capacitor; Manufacturer_Name: Vishay; Datasheet Link: http://www.vishay.com/docs/45200/vjhirelseries.pdf; Height: 1.7mm; Manufacturer_Part_Number: VJ1206A220JXGAT5Z; Mouser Part Number: 77-VJ1206A220JXGAT5Z; Mouser Price/Stock: https://www.mouser.co.uk/ProductDetail/Vishay-Vitramon/VJ1206A220JXGAT5Z?qs=UulECF1yA9GP5yydc6Uoow%3D%3D
Card = 009162006301150: Connector; Manufacturer_Name: AVX; Datasheet Link: http://datasheets.avx.com/LockingSIM_9162-300.pdf; Height: 2.5mm; Manufacturer_Part_Number: 009162006301150; Mouser Part Number: 581-009162006301150; Mouser Price/Stock: https://www.mouser.co.uk/ProductDetail/AVX/009162006301150?qs=3oXjESXZBsBVgHb8Ltya2A%3D%3D; Arrow Part Number: 009162006301150; Arrow Price/Stock: https://www.arrow.com/en/products/009162006301150/avx
D = ESDA6V1-5SC6: Integrated Circuit; Manufacturer_Name: STMicroelectronics; Datasheet Link: http://www.st.com/st-web-ui/static/active/en/resource/technical/document/datasheet/CD00005102.pdf; Height: 1.45mm; Manufacturer_Part_Number: ESDA6V1-5SC6; Mouser Part Number: 511-ESDA6V1-5SC6; Mouser Price/Stock: https://www.mouser.co.uk/ProductDetail/STMicroelectronics/ESDA6V1-5SC6?qs=ZN9SVtODT3yxqNpCUKP6Bg%3D%3D; Arrow Part Number: ESDA6V1-5SC6; Arrow Price/Stock: https://www.arrow.com/en/products/esda6v1-5sc6/stmicroelectronics?region=nac
D2 = MBRS360BT3G: Schottky Diodes & Rectifiers 60V,Schottky,SMA,3A; Manufacturer_Name: onsemi; Datasheet Link: http://www.onsemi.com/pub/Collateral/MBRS360T3-D.PDF; Height: 2.47mm; Manufacturer_Part_Number: MBRS360BT3G; Mouser Part Number: 863-MBRS360BT3G; Mouser Price/Stock: https://www.mouser.co.uk/ProductDetail/onsemi/MBRS360BT3G?qs=S9Eyls9TyKbavyAAp37J%252Bg%3D%3D; Arrow Part Number: MBRS360BT3G; Arrow Price/Stock: https://www.arrow.com/en/products/mbrs360bt3g/on-semiconductor
D3 = SMBJ36CA-TR: TVS Diode (Bi-directional) - SMBJ22A; Manufacturer_Name: STMicroelectronics; Datasheet Link: http://uk.rs-online.com/web/p/products/7958492; Height: 2.65mm; Manufacturer_Part_Number: SMBJ36CA-TR; Mouser Part Number: 511-SMBJ36CA-TR; Mouser Price/Stock: https://www.mouser.co.uk/ProductDetail/STMicroelectronics/SMBJ36CA-TR?qs=SoAZXCQuyY%252BvVRKvkB14ug%3D%3D; Arrow Part Number: SMBJ36CA-TR; Arrow Price/Stock: https://www.arrow.com/en/products/smbj36ca-tr/stmicroelectronics?region=europe
IC1 = LM2596S-12_NOPB: Integrated Circuit; Manufacturer_Name: Texas Instruments; Manufacturer_Part_Number: LM2596S-12/NOPB; Datasheet Link: http://www.ti.com/lit/ds/symlink/lm2596.pdf; Height: 4.65mm; Mouser Part Number: 926-LM2596S-12/NOPB; Mouser Price/Stock: https://www.mouser.co.uk/ProductDetail/Texas-Instruments/LM2596S-12-NOPB?qs=X1J7HmVL2ZF8LB%2FmfveaIg%3D%3D; Arrow Part Number: LM2596S-12/NOPB; Arrow Price/Stock: https://www.arrow.com/en/products/lm2596s-12nopb/texas-instruments?region=nac
L1 = RLH0912-101KL: 100uH 10% tolerance 900mA Inductor; Manufacturer_Name: Bourns; Datasheet Link: https://www.google.com/url?sa=t&rct=j&q=&esrc=s&source=web&cd=&ved=2ahUKEwjz1aCsps70AhWJ3oUKHQXqBgMQFnoECA0QAQ&url=https%3A%2F%2Fwww.bourns.com%2Fpdfs%2Frlb.pdf&usg=AOvVaw0e0GPLRrDgk_KnlxXDz6FJ; Height: 11mm; Manufacturer_Part_Number: RLH0912-101KL; Mouser Part Number: 652-RLH0912-101KL; Mouser Price/Stock: https://www.mouser.co.uk/ProductDetail/Bourns/RLH0912-101KL?qs=SUrgTEU5cSrf3ut5JjToyw%3D%3D
LED2 = 150120GS75000: LED; Manufacturer_Name: Wurth Elektronik; Height: 0.78mm; Manufacturer_Part_Number: 150120GS75000; Mouser Part Number: 710-150120GS75000; Mouser Price/Stock: https://www.mouser.co.uk/ProductDetail/Wurth-Elektronik/150120GS75000?qs=LlUlMxKIyB3I3AMxrmBw4A%3D%3D
R13 R18 = PHPA1206E1001BST1: 2.2K 1% tolerance Resistor; Manufacturer_Name: Vishay; Datasheet Link: https://www.vishay.com/docs/60160/phpa.pdf; Height: 0.508mm; Manufacturer_Part_Number: PHPA1206E1001BST1; Mouser Part Number: 71-PHPA1206E1001BST1; Mouser Price/Stock: https://www.mouser.co.uk/ProductDetail/Vishay-Thin-Film/PHPA1206E1001BST1?qs=QNEnbhJQKvai8SEWbiX%2FTw%3D%3D
R14 R17 R22 = PHPA1206E1001BST1: 1K 1% tolerance Resistor; Manufacturer_Name: Vishay; Datasheet Link: https://www.vishay.com/docs/60160/phpa.pdf; Height: 0.508mm; Manufacturer_Part_Number: PHPA1206E1001BST1; Mouser Part Number: 71-PHPA1206E1001BST1; Mouser Price/Stock: https://www.mouser.co.uk/ProductDetail/Vishay-Thin-Film/PHPA1206E1001BST1?qs=QNEnbhJQKvai8SEWbiX%2FTw%3D%3D
R15 = PHPA1206E1001BST1: 180ohm 1% tolerance Resistor; Manufacturer_Name: Vishay; Datasheet Link: https://www.vishay.com/docs/60160/phpa.pdf; Height: 0.508mm; Manufacturer_Part_Number: PHPA1206E1001BST1; Mouser Part Number: 71-PHPA1206E1001BST1; Mouser Price/Stock: https://www.mouser.co.uk/ProductDetail/Vishay-Thin-Film/PHPA1206E1001BST1?qs=QNEnbhJQKvai8SEWbiX%2FTw%3D%3D
R16 = PHPA1206E1001BST1: 100ohm 1% tolerance Resistor; Manufacturer_Name: Vishay; Datasheet Link: https://www.vishay.com/docs/60160/phpa.pdf; Height: 0.508mm; Manufacturer_Part_Number: PHPA1206E1001BST1; Mouser Part Number: 71-PHPA1206E1001BST1; Mouser Price/Stock: https://www.mouser.co.uk/ProductDetail/Vishay-Thin-Film/PHPA1206E1001BST1?qs=QNEnbhJQKvai8SEWbiX%2FTw%3D%3D
R19-R21 = CRCW120651R0FKEAC: 51ohm 1% tolerance Resistor; Manufacturer_Name: Vishay; Datasheet Link: http://componentsearchengine.com/Datasheets/1/CRCW120651R0FKEAC.pdf; Height: 0.6mm; Manufacturer_Part_Number: CRCW120651R0FKEAC; Mouser Part Number: 71-CRCW120651R0FKEAC; Mouser Price/Stock: https://www.mouser.co.uk/ProductDetail/Vishay-Dale/CRCW120651R0FKEAC?qs=E3Y5ESvWgWOS4uisdbRXsg%3D%3D; Arrow Part Number: CRCW120651R0FKEAC; Arrow Price/Stock: https://www.arrow.com/en/products/crcw120651r0fkeac/vishay?region=nac
SW = PHPA1206E1001BST1: 2 Pin switch; Manufacturer_Name: Vishay; Datasheet Link: https://www.vishay.com/docs/60160/phpa.pdf; Height: 0.508mm; Manufacturer_Part_Number: PHPA1206E1001BST1; Mouser Part Number: 71-PHPA1206E1001BST1; Mouser Price/Stock: https://www.mouser.co.uk/ProductDetail/Vishay-Thin-Film/PHPA1206E1001BST1?qs=QNEnbhJQKvai8SEWbiX%2FTw%3D%3D
U2 = SIM800C: Module: GSM/Bluetooth; GPRS; 2G; 1800MHz, 900MHz; 85.6kbps; SMD; MF: Simcom; Check_prices: https://www.snapeda.com/parts/SIM800C/SIMcom+Wireless+solutions+Co.%252CLtd/view-part/?ref=eda; Value: *; Availability: In Stock; MP: SIM800C; Price: None; Package: None; SnapEDA_Link: https://www.snapeda.com/parts/SIM800C/SIMcom+Wireless+solutions+Co.%252CLtd/view-part/?ref=snap
Z1 = MMSZ5231C-E3-08: Zener Diode 5.1V 500mW; Manufacturer_Name: Vishay; Datasheet Link: https://www.arrow.com/en/products/mmsz5231c-e3-08/vishay; Height: 1.35mm; Manufacturer_Part_Number: MMSZ5231C-E3-08; Mouser Part Number: 78-MMSZ5231C-E3-08; Mouser Price/Stock: https://www.mouser.co.uk/ProductDetail/Vishay-Semiconductors/MMSZ5231C-E3-08?qs=S660mHfF5o35EDHKMfkp8w%3D%3D; Arrow Part Number: MMSZ5231C-E3-08; Arrow Price/Stock: https://www.arrow.com/en/products/mmsz5231c-e3-08/vishay

## Nets that join several sheets
GND: GSM SA Schematic (28 pins), SIM800C SCH (34 pins)
5V: GSM SA Schematic (15 pins), SIM800C SCH (C7.1 C8.1 IC1.1)
RXD: GSM SA Schematic (IC.15 U1.15), SIM800C SCH (R17.1)
TXD: GSM SA Schematic (IC.14 U1.14), SIM800C SCH (R22.2)